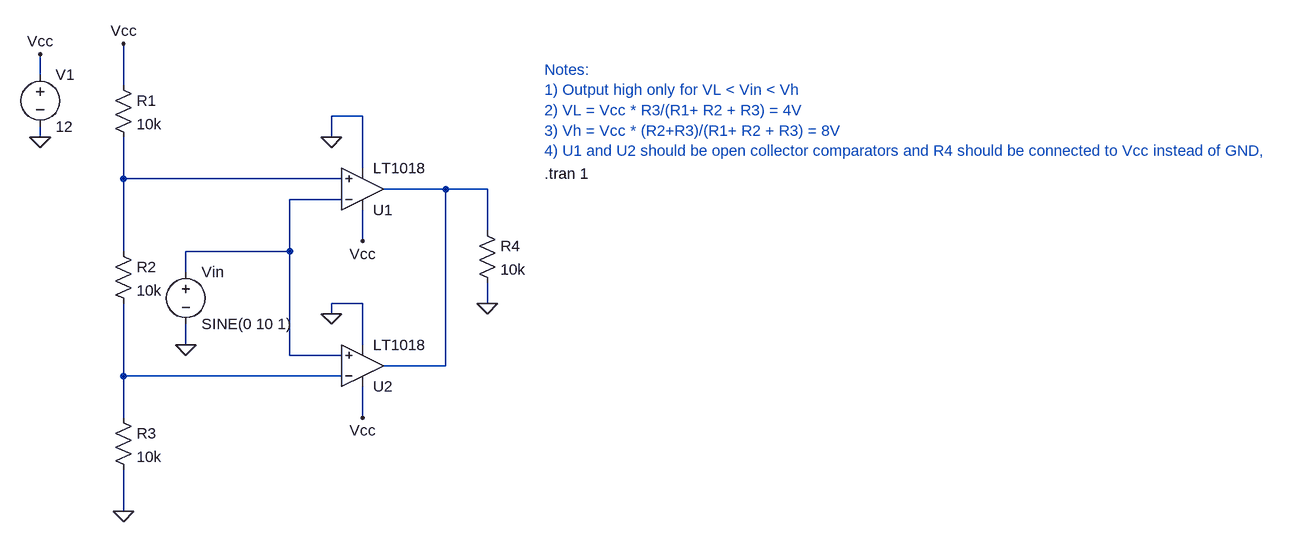
[diagram p0: schematic Window-comparator.asc]
Window-comparator.asc, the LTspice schematic file:
Version 4
SHEET 1 2144 692
WIRE 192 0 192 -32
WIRE 320 16 320 -48
WIRE 688 64 640 64
WIRE 192 96 192 80
WIRE 640 96 640 64
WIRE 688 144 688 64
WIRE 320 160 320 96
WIRE 656 160 320 160
WIRE 816 176 720 176
WIRE 880 176 816 176
WIRE 656 192 576 192
WIRE 880 240 880 176
WIRE 688 256 688 208
WIRE 320 272 320 160
WIRE 576 272 576 192
WIRE 576 272 416 272
WIRE 416 304 416 272
WIRE 688 352 640 352
WIRE 880 352 880 320
WIRE 640 368 640 352
WIRE 416 416 416 384
WIRE 688 416 688 352
WIRE 576 432 576 272
WIRE 656 432 576 432
WIRE 816 448 816 176
WIRE 816 448 720 448
WIRE 320 464 320 352
WIRE 656 464 320 464
WIRE 320 528 320 464
WIRE 688 528 688 480
WIRE 320 672 320 608
FLAG 192 96 0
FLAG 192 -32 Vcc
FLAG 416 416 0
FLAG 320 -48 Vcc
FLAG 688 528 Vcc
FLAG 640 368 0
FLAG 320 672 0
FLAG 880 352 0
FLAG 688 256 Vcc
FLAG 640 96 0
SYMBOL voltage 192 -16 R0
WINDOW 123 0 0 Left 0
WINDOW 39 0 0 Left 0
SYMATTR InstName V1
SYMATTR Value 12
SYMBOL voltage 416 288 R0
WINDOW 123 0 0 Left 0
WINDOW 39 0 0 Left 0
SYMATTR InstName Vin
SYMATTR Value SINE(0 10 1)
SYMBOL Comparators\\LT1018 688 448 M180
SYMATTR InstName U2
SYMBOL res 304 0 R0
SYMATTR InstName R1
SYMATTR Value 10k
SYMBOL res 304 256 R0
SYMATTR InstName R2
SYMATTR Value 10k
SYMBOL res 304 512 R0
SYMATTR InstName R3
SYMATTR Value 10k
SYMBOL res 864 224 R0
SYMATTR InstName R4
SYMATTR Value 10k
SYMBOL Comparators\\LT1018 688 176 M180
SYMATTR InstName U1
TEXT 968 152 Left 2 !.tran 1
TEXT 968 -8 Left 2 ;Notes:\n1) Output high only for VL < Vin < Vh\n2) VL = Vcc * R3/(R1+ R2 + R3) = 4V\n3) Vh = Vcc * (R2+R3)/(R1+ R2 + R3) = 8V\n4) U1 and U2 should be open collector comparators and R4 should be connected to Vcc instead of GND,

The netlist it stands for:
* Window-comparator.asc
V1 Vcc 0 12
Vin N003 0 SINE(0 10 1)
XU2 N003 N004 Vcc 0 N002 LT1018  ; pins In+ In- V+ V- OUT
R1 Vcc N001 10k
R2 N001 N004 10k
R3 N004 0 10k
R4 N002 0 10k
XU1 N001 N003 Vcc 0 N002 LT1018  ; pins In+ In- V+ V- OUT
.tran 1
* Notes:
* 1) Output high only for VL < Vin < Vh
* 2) VL = Vcc * R3/(R1+ R2 + R3) = 4V
* 3) Vh = Vcc * (R2+R3)/(R1+ R2 + R3) = 8V
* 4) U1 and U2 should be open collector comparators and R4 should be connected to Vcc instead of GND,
.lib LTC1.lib
.backanno
.end